# Altium schematic sheet BTL_RELAY.SchDoc: BTL_SmartHome
size A4; Organization: HCMUT; Address1: 268 Ly Thuong Kiet; Address2: Dien Hong Ward; Address3: HCMC; Address4: (+84) 98 380 3257; SheetNumber: 3; SheetTotal: 3
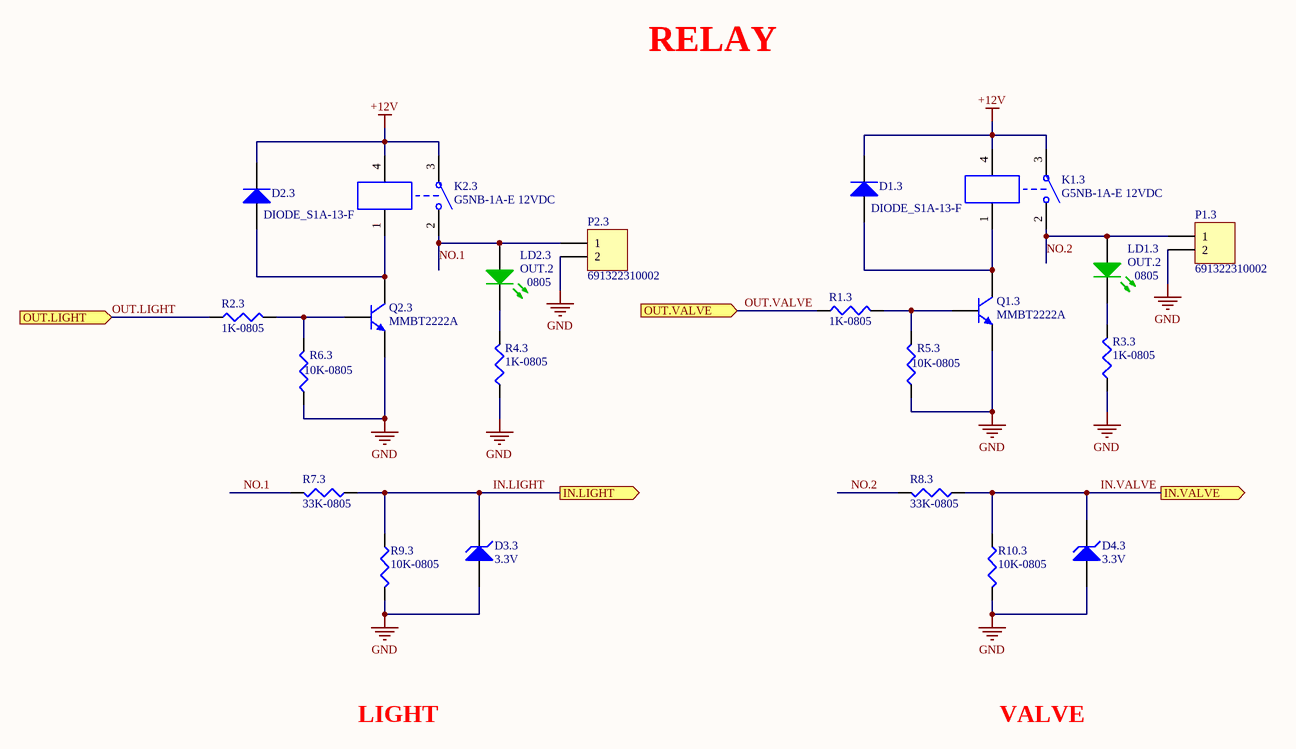
[diagram p0: BTL_RELAY.SchDoc]

## Parts
D1.3  DIODE_S1A-13-F  [DO-214AC]
D2.3  DIODE_S1A-13-F  [DO-214AC]
D3.3  3.3V  [SOD123]
D4.3  3.3V  [SOD123]
K1.3  G5NB-1A-E 12VDC  [RELAY-G5NB-1A-E 24VDC]
K2.3  G5NB-1A-E 12VDC  [RELAY-G5NB-1A-E 24VDC]
LD1.3  OUT.2  Package / Case: 0805  [LED_SMD0805_GREEN]
LD2.3  OUT.2  Package / Case: 0805  [LED_SMD0805_GREEN]
P1.3  691322310002  [TERMINAL_KF2EDGR_F_1X2_3.81]
P2.3  691322310002  [TERMINAL_KF2EDGR_F_1X2_3.81]
Q1.3  MMBT2222A  [SOT23-3]
Q2.3  MMBT2222A  [SOT23-3]
R1.3  1K-0805  [RES0805]
R2.3  1K-0805  [RES0805]
R3.3  1K-0805  [RES0805]
R4.3  1K-0805  [RES0805]
R5.3  10K-0805  [RES0805]
R6.3  10K-0805  [RES0805]
R7.3  33K-0805  [RES0805]
R8.3  33K-0805  [RES0805]
R9.3  10K-0805  [RES0805]
R10.3  10K-0805  [RES0805]

## Ports
IN.LIGHT (out), IN.VALVE (out), OUT.LIGHT (in), OUT.VALVE (in)

## Nets
+12V: D1.3.2(K) D2.3.2(K) K1.3.3(NO) K1.3.4 K2.3.3(NO) K2.3.4
GND: D3.3.1(A) D4.3.1(A) P1.3.2 P2.3.2 Q1.3.2(E) Q2.3.2(E) R3.3.1 R4.3.1 R5.3.1 R6.3.1 R9.3.2 R10.3.2
IN.LIGHT: D3.3.2(K) R7.3.1 R9.3.1 ; port IN.LIGHT
IN.VALVE: D4.3.2(K) R8.3.1 R10.3.1 ; port IN.VALVE
NO.1: K2.3.2(NC) LD2.3.1(A) P2.3.1 R7.3.2
NO.2: K1.3.2(NC) LD1.3.1(A) P1.3.1 R8.3.2
OUT.LIGHT: R2.3.1 ; port OUT.LIGHT
OUT.VALVE: R1.3.1 ; port OUT.VALVE
NetD1.3_1: D1.3.1(A) K1.3.1(COM) Q1.3.3(C)
NetD2.3_1: D2.3.1(A) K2.3.1(COM) Q2.3.3(C)
NetLD1.3_2: LD1.3.2(K) R3.3.2
NetLD2.3_2: LD2.3.2(K) R4.3.2
NetQ1.3_1: Q1.3.1(B) R1.3.2 R5.3.2
NetQ2.3_1: Q2.3.1(B) R2.3.2 R6.3.2

## Notes on the sheet
- RELAY
- LIGHT
- VALVE
- Title
- Size:
- Date:
- Author:
- A4
- Number:
- Time:
- Checked:
- Revision:
- Sheet
- Approved:
- of
- File:

## Library data of the parts
D1.3 D2.3 = DIODE_S1A-13-F: DIODE GEN PURP 50V 1A SMA; Manufacturer: Diodes Incorporated; Diode Type: Standard; Speed: Standard Recovery >500ns, > 200mA (Io); Capacitance @ Vr, F: 10pF @ 4V, 1MHz; Supplier 1: Digi-Key; Manufacturer Part Number: S1A-13-F; RoHS: RoHS Compliant; Category: Discrete Semiconductor Products; Stock 1: 293435; Pricing 1: 1=0.27, 10=0.219, 100=0.1163, 500=0.07652, 1000=0.05203 (USD); Packaging: Digi-Reel®; Part Status: Active; Current - Average Rectified (Io): 1A; Mounting Type: Surface Mount; Package / Case: DO-214AC, SMA; Supplier Device Package: SMA; Operating Temperature - Junction: -65°C ~ 150°C; Base Part Number: S1A; ComponentLink1URL: https://www.diodes.com/assets/Datasheets/ds16003.pdf; ComponentLink1Description: https://www.diodes.com/assets/Datasheets/ds16003.pdf; Supplier Part Number 1: S1A-FDIDKR-ND
D3.3 D4.3 = D Zener: Zener Diode; Published: 8-Jun-2000; LatestRevisionDate: 17-Jul-2002; LatestRevisionNote: Re-released for DXP Platform.; PackageReference: DIODE-0.7; Publisher: Altium Limited
K1.3 K2.3 = Relay-G5NB-1A-E 24VDC: Relay 24VDC SPST-NO General Purpose / Industrial; Published: 24-Mar-1999; LatestRevisionDate: 17-Jul-2002; LatestRevisionNote: Re-released for DXP Platform.; PackageReference: DIP-P8; Publisher: Altium Limited
LD1.3 LD2.3 = LED_LTST-C171KGKT: LED GREEN CLEAR 0805 SMD; Manufacturer: Lite-On Inc.; Lens Color: Colorless; Millicandela Rating: 35mcd; Lens Style/Size: Rectangle with Flat Top, 1.40mm x 1.25mm; Voltage - Forward (Vf) (Typ): 2V; Current - Test: 20mA; Viewing Angle: 130°; Wavelength - Dominant: 571nm; Wavelength - Peak: 574nm; Supplier 1: Digi-Key; Manufacturer Part Number: LTST-C171KGKT; RoHS: RoHS Compliant; Category: Optoelectronics; Stock 1: 329702; Pricing 1: 1=0.35, 10=0.255, 25=0.188, 100=0.1344, 250=0.09136, 500=0.08062, 1000=0.06314 (USD); Packaging: Cut Tape (CT); Part Status: Active; Color: Green; Lens Transparency: Clear; Mounting Type: Surface Mount; Features: -; Size / Dimension: 2.00mm L x 1.25mm W; Height (Max): 0.90mm; ComponentLink1URL: http://optoelectronics.liteon.com/upload/download/DS22-2000-118/LTST-C171KGKT.pdf; ComponentLink1Description: http://optoelectronics.liteon.com/upload/download/DS22-2000-118/LTST-C171KGKT.pdf; Supplier Part Number 1: 160-1426-1-ND
P1.3 P2.3 = TERMINAL_KF2EDGR_F_1X2_3.81: TERM BLOCK HDR 2POS 90DEG 3.81MM; Manufacturer: Wurth Electronics Inc.; Number of Positions: 2; Number of Levels: 1; Pitch: 0.150" (3.81mm); Header Orientation: 90°, Right Angle; Material Flammability Rating: UL94 V-0; Contact Tail Length: 0.138" (3.50mm); Supplier 1: Digi-Key; Manufacturer Part Number: 691322310002; RoHS: RoHS Compliant; Category: Connectors, Interconnects; Stock 1: 1180; Pricing 1: 1=0.33, 10=0.296, 50=0.255, 100=0.2375 (USD); Packaging: Bulk; Part Status: Active; Type: Header, Male Pins, Shrouded (4 Side); Positions Per Level: 2; Plug Wire Entry: -; Termination Style: Solder; Mounting Type: Through Hole; Current - IEC: -; Wire Gauge or Range - AWG: -; Wire Gauge or Range - mm²: -; Color: Green; Operating Temperature: -40°C ~ 105°C; Contact Mating Finish: Tin; Features: -; Ingress Protection: -; Screw Size: -; Torque - Screw: -; Wire Strip Length: -; Contact Material: Brass; Housing Material: Polyamide (PA66), Nylon 6/6; Insulation Height: 0.276" (7.00mm); ComponentLink1URL: http://katalog.we-online.de/em/datasheet/6913223100xx.pdf; ComponentLink1Description: http://katalog.we-online.de/em/datasheet/6913223100xx.pdf; Supplier Part Number 1: 732-2088-ND
Q1.3 Q2.3 = MMBT2222A: TRANS NPN 40V 1A SOT-23; Manufacturer: ON Semiconductor; Vce Saturation (Max) @ Ib, Ic: 1V @ 50mA, 500mA; Current - Collector Cutoff (Max): 10nA (ICBO); DC Current Gain (hFE) (Min) @ Ic, Vce: 100 @ 150mA, 10V; Frequency - Transition: 300MHz; Supplier 1: Digi-Key; Manufacturer Part Number: MMBT2222A; RoHS: RoHS Compliant; Category: Discrete Semiconductor Products; Stock 1: 220769; Pricing 1: 1=0.21, 10=0.17, 100=0.09, 500=0.05922, 1000=0.04027 (USD); Packaging: Cut Tape (CT); Part Status: Last Time Buy; Transistor Type: NPN; Operating Temperature: 150°C (TJ); Mounting Type: Surface Mount; Package / Case: TO-236-3, SC-59, SOT-23-3; Supplier Device Package: SOT-23-3; Base Part Number: MMBT2222; ComponentLink1URL: https://www.fairchildsemi.com/datasheets/MM/MMBT2222A.pdf; ComponentLink1Description: https://www.fairchildsemi.com/datasheets/MM/MMBT2222A.pdf; Supplier Part Number 1: MMBT2222AFSCT-ND
R1.3 R2.3 R3.3 R4.3 R5.3 R6.3 R7.3 R8.3 R9.3 R10.3 = AC0805JR-070RL: RES SMD 0.0OHM JUMPER 1/8W 0805; Manufacturer 1: Yageo; Category 1: Resistors; Resistance (Ohms): 0.0; Power (Watts): 0.125W, 1/8W; Value: 0R; Supplier 1: Digi-Key; Manufacturer Part Number 1: AC0805JR-070RL; RoHS 1: RoHS Compliant; Description 1: RES SMD 0.0OHM JUMPER 1/8W 0805; Stock 1: 16192; Pricing 1: 1=0.1, 10=0.03, 25=0.022, 50=0.0166, 100=0.0123, 250=0.00936, 500=0.00748, 1000=0.00551 (USD); Packaging: Cut Tape (CT); Part Status: Active; Tolerance: Jumper; Composition: Thick Film; Features: Automotive AEC-Q200, Moisture Resistant; Temperature Coefficient: -; Operating Temperature: -55°C ~ 155°C; Package / Case: 0805 (2012 Metric); Supplier Device Package: 0805; Size / Dimension: 0.079" L x 0.049" W (2.00mm x 1.25mm); Height - Seated (Max): 0.024" (0.60mm); Failure Rate: -; ComponentLink1URL: http://www.yageo.com/NewPortal/yageodocoutput?fileName=/pdf/R-Chip/PYu-AC_51_RoHS_L_5.pdf; ComponentLink1Description: http://www.yageo.com/NewPortal/yageodocoutput?fileName=/pdf/R-Chip/PYu-AC_51_RoHS_L_5.pdf; Supplier Part Number 1: YAG3755CT-ND